# Altium project GS_V1.PrjPcb
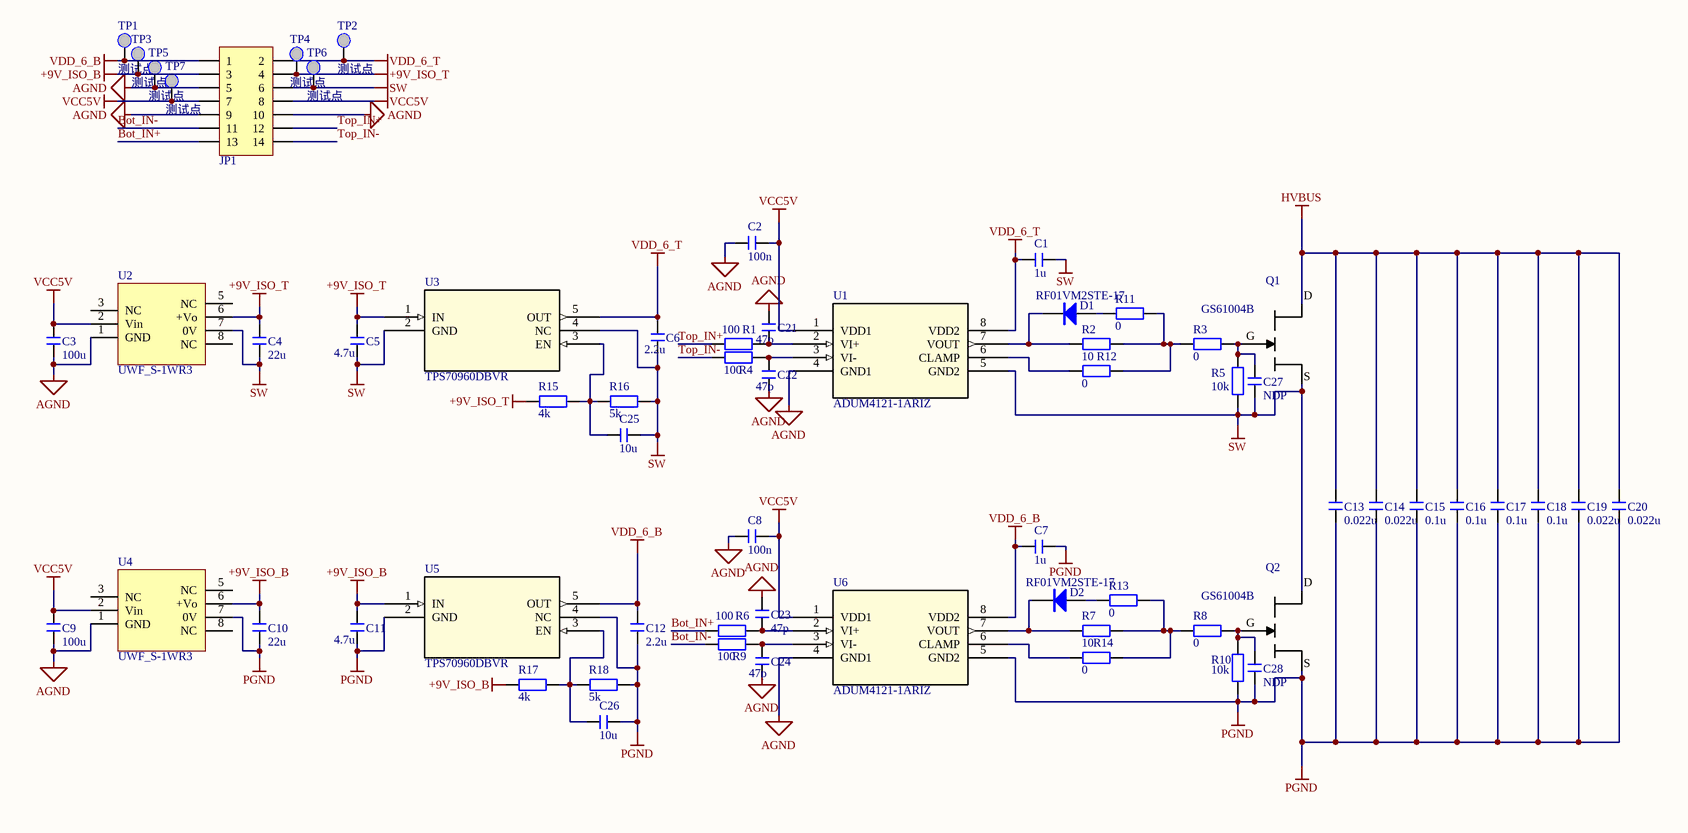
[diagram p0: GS_V1.SchDoc]
1 sheet, 64 parts. Net scope: global (net labels, ports and power ports of the same name join across sheets).
Board file: GS_V1.PcbDoc

## Sheet GS_V1.SchDoc
size A2; SheetNumber: 1; SheetTotal: 1

### Parts
C1  1u  [C 0603_L]
C2  100n  [C 0603_L]
C3  100u  [C 0805_L]
C4  22u  [C 0603_L]
C5  4.7u  [C 0603_L]
C6  2.2u  [C 0603_L]
C7  1u  [C 0603_L]
C8  100n  [C 0603_L]
C9  100u  [C 0805_L]
C10  22u  [C 0603_L]
C11  4.7u  [C 0603_L]
C12  2.2u  [C 0603_L]
C13  0.022u  [C 0805_L]
C14  0.022u  [C 0805_L]
C15  0.1u  [C 0805_L]
C16  0.1u  [C 0805_L]
C17  0.1u  [C 0805_L]
C18  0.1u  [C 0805_L]
C19  0.022u  [C 0805_L]
C20  0.022u  [C 0805_L]
C21  47p  [C 0603_L]
C22  47p  [C 0603_L]
C23  47p  [C 0603_L]
C24  47p  [C 0603_L]
C25  10u  [C 0603_L]
C26  10u  [C 0603_L]
C27  NDP  [C 0603_L]
C28  NDP  [C 0603_L]
D1  RF01VM2STE-17  [SOD-323]
D2  RF01VM2STE-17  [SOD-323]
JP1  Header 2X7  [HDR2.54-LI-2x7P]  (value not drawn)
Q1  GS61004B  [GS61004B]
Q2  GS61004B  [GS61004B]
R1  100  [R 0603_L]
R2  10  [R 0603_L]
R3  0  [R 0603_L]
R4  100  [R 0603_L]
R5  10k  [R 0603_L]
R6  100  [R 0603_L]
R7  10  [R 0603_L]
R8  0  [R 0603_L]
R9  100  [R 0603_L]
R10  10k  [R 0603_L]
R11  0  [R 0603_L]
R12  0  [R 0603_L]
R13  0  [R 0603_L]
R14  0  [R 0603_L]
R15  4k  [R 0603_L]
R16  5k  [R 0603_L]
R17  4k  [R 0603_L]
R18  5k  [R 0603_L]
TP1  测试点  [tp32]
TP2  测试点  [tp32]
TP3  测试点  [tp32]
TP4  测试点  [tp32]
TP5  测试点  [tp32]
TP6  测试点  [tp32]
TP7  测试点  [tp32]
U1  ADUM4121-1ARIZ  [RI-8-1_ADI]
U2  UWF_S-1WR3  [UWF_S-1WR3]
U3  TPS70960DBVR  [DBV5_TEX]
U4  UWF_S-1WR3  [UWF_S-1WR3]
U5  TPS70960DBVR  [DBV5_TEX]
U6  ADUM4121-1ARIZ  [RI-8-1_ADI]

### Nets
+9V_ISO_B: C10.2 C11.2 JP1.3 R17.2 TP3.1 U4.6(+Vo) U5.1(IN)
+9V_ISO_T: C4.2 C5.2 JP1.4 R15.2 TP4.1 U2.6(+Vo) U3.1(IN)
AGND: C2.2 C3.1 C8.2 C9.1 C21.2 C22.1 C23.1 C24.1 JP1.5 JP1.9 JP1.10 TP5.1 U1.4(GND1) U2.1(GND) U4.1(GND) U6.4(GND1)
HVBUS: C13.2 C14.2 C15.2 C16.2 C17.2 C18.2 C19.2 C20.2 Q1.D
PGND: C7.2 C10.1 C11.1 C12.1 C13.1 C14.1 C15.1 C16.1 C17.1 C18.1 C19.1 C20.1 C26.1 C28.2 Q2.S R10.1 R18.1 U4.7(0V) U5.2(GND) U5.4(NC) U6.5(GND2)
SW: C1.2 C4.1 C5.1 C6.1 C25.1 C27.2 JP1.6 Q1.S Q2.D R5.1 R16.1 TP6.1 U1.5(GND2) U2.7(0V) U3.2(GND) U3.4(NC)
VCC5V: C2.1 C3.2 C8.1 C9.2 JP1.7 JP1.8 TP7.1 U1.1(VDD1) U2.2(Vin) U4.2(Vin) U6.1(VDD1)
VDD_6_B: C7.1 C12.2 JP1.1 TP1.1 U5.5(OUT) U6.8(VDD2)
VDD_6_T: C1.1 C6.2 JP1.2 TP2.1 U1.8(VDD2) U3.5(OUT)
Bot_IN+: JP1.13 R6.1
Bot_IN-: JP1.11 R9.1
Top_IN+: JP1.12 R1.1
Top_IN-: JP1.14 R4.1
NetC21_1: C21.1 R1.2 U1.2(VI+)
NetC22_2: C22.2 R4.2 U1.3(VI-)
NetC23_2: C23.2 R6.2 U6.2(VI+)
NetC24_2: C24.2 R9.2 U6.3(VI-)
NetC25_2: C25.2 R15.1 R16.2 U3.3(EN)
NetC26_2: C26.2 R17.1 R18.2 U5.3(EN)
NetC27_1: C27.1 Q1.G R3.2 R5.2
NetC28_1: C28.1 Q2.G R8.2 R10.2
NetD1_1: D1.1(A) R11.1
NetD1_2: D1.2(K) R2.1 U1.7(VOUT)
NetD2_1: D2.1(A) R13.1
NetD2_2: D2.2(K) R7.1 U6.7(VOUT)
NetR2_2: R2.2 R3.1 R11.2 R12.2
NetR7_2: R7.2 R8.1 R13.2 R14.2
NetR12_1: R12.1 U1.6(CLAMP)
NetR14_1: R14.1 U6.6(CLAMP)

Not connected (* = marked no-connect by the designer): U2 3(NC) 5(NC) 8(NC); U4 3(NC) 5(NC) 8(NC)

### Library data of the parts
C1-C28 = C: 无极性贴片电容; 版权归属: 源创客; 材质: X7R; BOM名称: 无极性贴片电容; 学习资源: www.ooocke.com
D1 D2 = 1N5819: 肖特基二极管; 版权归属: 源创客; 属性: 40V/2A; BOM名称: 肖特基二极管; 学习资源: www.ooocke.com
JP1 = Header 7X2: 7*2P接插件; 版权归属: 源创客; BOM名称: 7*2P接插件; 学习资源: www.ooocke.com
Q1 Q2 = GS61004B: GAN TRANS E-MODE 100V
R1-R18 = R: 贴片电阻; 版权归属: 源创客; BOM名称: 贴片电阻; 学习资源: www.ooocke.com
TP1-TP7 = TestPoint: 元件描述: 电源和信号测试点; 贴片和直插: 机械组装; 是否安装: 否; Value: 测试点
U1 U6 = ADUM4121-1ARIZ: No Description Available; Mfr_Name: Analog Devices Inc; Type: Isolators - Gate Drivers; RefDes: RefDes
U3 U5 = TPS70960DBVR: No Description Available; Mfr_Name: Texas Instruments; RefDes: RefDes; Type: Type